# Altium schematic sheet sc16is752.SchDoc
size A4
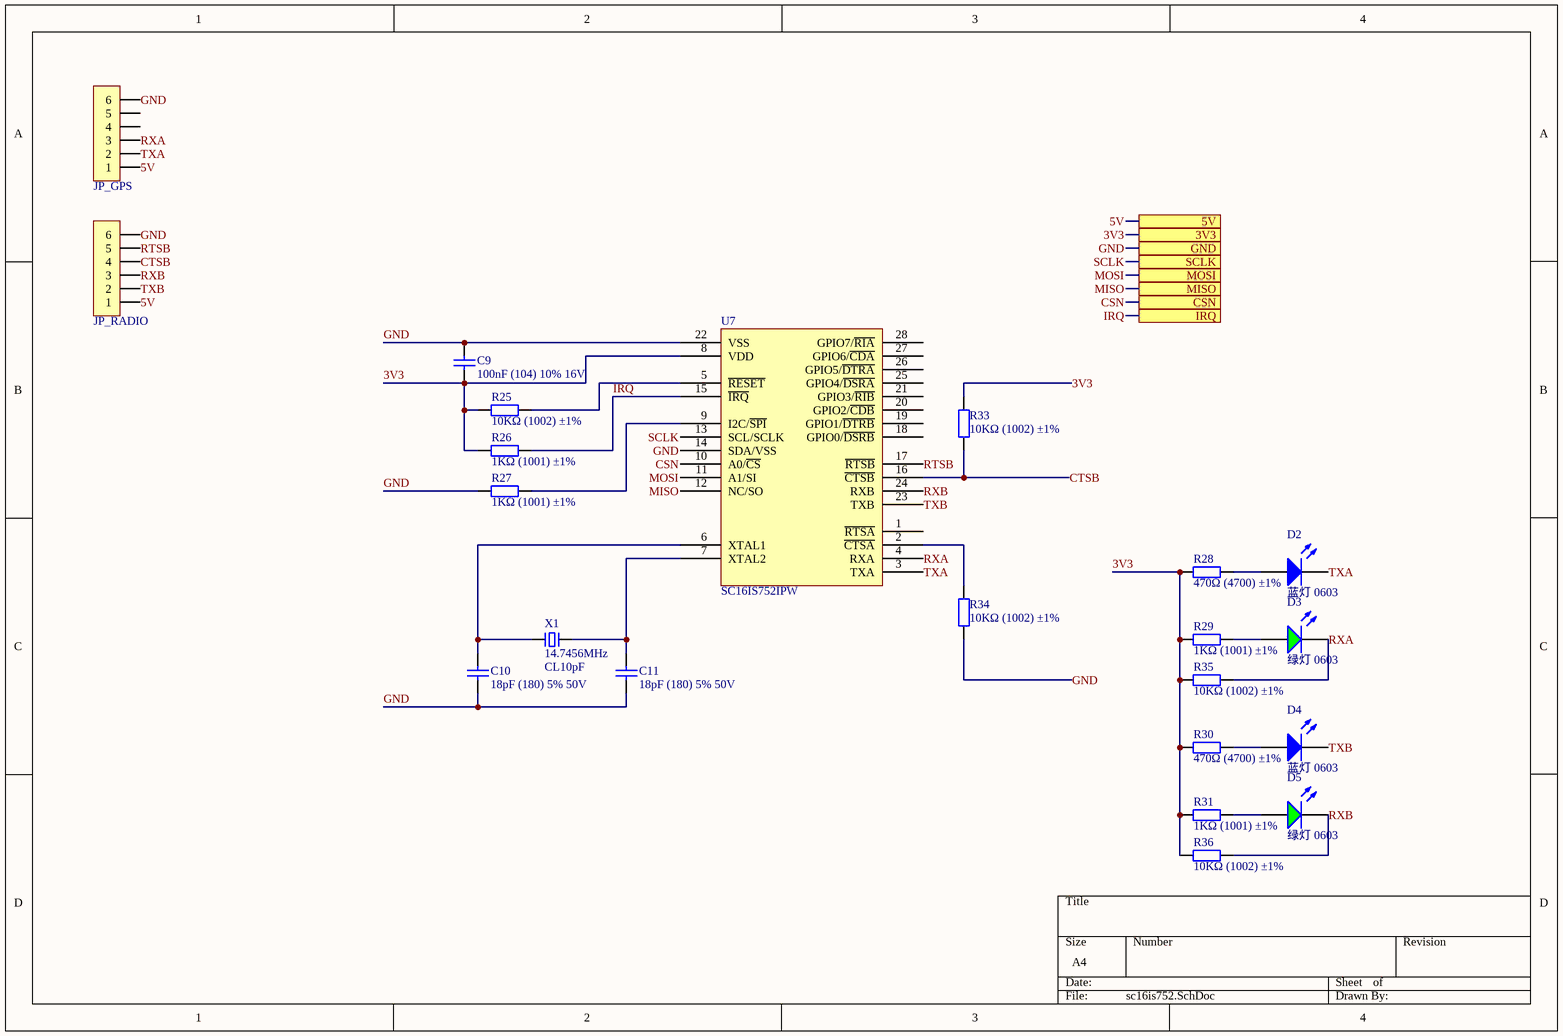
[diagram p0: sc16is752.SchDoc]

## Parts
C9  100nF (104) 10% 16V  [0402_C]
C10  18pF (180) 5% 50V  [0402_C]
C11  18pF (180) 5% 50V  [0402_C]
D2  蓝灯 0603  [0603_LED_S1]
D3  绿灯 0603  [0603_LED_S1]
D4  蓝灯 0603  [0603_LED_S1]
D5  绿灯 0603  [0603_LED_S1]
JP_GPS  HDR-1X6  [MX 1.25-WS-6P]  (value not drawn)
JP_RADIO  HDR-1X6  [MX 1.25-WS-6P]  (value not drawn)
R25  10KΩ (1002) ±1%  [0402_R]
R26  1KΩ (1001) ±1%  [0402_R]
R27  1KΩ (1001) ±1%  [0402_R]
R28  470Ω (4700) ±1%  [0402_R]
R29  1KΩ (1001) ±1%  [0402_R]
R30  470Ω (4700) ±1%  [0402_R]
R31  1KΩ (1001) ±1%  [0402_R]
R33  10KΩ (1002) ±1%  [0402_R]
R34  10KΩ (1002) ±1%  [0402_R]
R35  10KΩ (1002) ±1%  [0402_R]
R36  10KΩ (1002) ±1%  [0402_R]
U7  SC16IS752IPW  [TSSOP28_n]
X1  14.7456MHz  负载电容: CL10pF  [OSC HC-49SMD]

## Ports
3V3, 5V, CSN, GND, IRQ, MISO, MOSI, SCLK

## Nets
3V3: C9.1 R25.1 R26.1 R28.1 R29.1 R30.1 R31.1 R33.2 R35.2 R36.2 U7.8(VDD) ; port 3V3
5V: JP_GPS.1 JP_RADIO.1 ; port 5V
CSN: U7.10(A0/~{CS}) ; port CSN
CTSB: JP_RADIO.4 R33.1 U7.16(~{CTSB})
GND: C9.2 C10.1 C11.1 JP_GPS.6 JP_RADIO.6 R27.1 R34.1 U7.14(SDA/VSS) U7.22(VSS) ; port GND
IRQ: R26.2 U7.15(~{IRQ}) ; port IRQ
MISO: U7.12(NC/SO) ; port MISO
MOSI: U7.11(A1/SI) ; port MOSI
RTSB: JP_RADIO.5 U7.17(~{RTSB})
RXA: D3.K JP_GPS.3 R35.1 U7.4(RXA)
RXB: D5.K JP_RADIO.3 R36.1 U7.24(RXB)
SCLK: U7.13(SCL/SCLK) ; port SCLK
TXA: D2.K JP_GPS.2 U7.3(TXA)
TXB: D4.K JP_RADIO.2 U7.23(TXB)
NetC10_2: C10.2 U7.6(XTAL1) X1.1
NetC11_2: C11.2 U7.7(XTAL2) X1.2
NetD2_A: D2.A R28.2
NetD3_A: D3.A R29.2
NetD4_A: D4.A R30.2
NetD5_A: D5.A R31.2
NetR25_2: R25.2 U7.5(~{RESET})
NetR27_2: R27.2 U7.9(I2C/~{SPI})
NetR34_2: R34.2 U7.2(~{CTSA})

Not connected (* = marked no-connect by the designer): JP_GPS 4 5; U7 1(~{RTSA}) 18(GPIO0/~{DSRB}) 19(GPIO1/~{DTRB}) 20(GPIO2/~{CDB}) 21(GPIO3/~{RIB}) 25(GPIO4/~{DSRA}) 26(GPIO5/~{DTRA}) 27(GPIO6/~{CDA}) 28(GPIO7/~{RIA})

## Library data of the parts
C9 = 0402 100nF (104) 10% 16V: 贴片电容; ComponentLink1Description: 供应商链接; ComponentLink1URL: http://www.szlcsc.com/product/details_1877.html; Package: 0402; Supplier: LC; SuppliersPartNumber: C1525
C10 C11 = 0402 18pF (180) 5% 50V: 贴片电容; ComponentLink1Description: 供应商链接; ComponentLink1URL: http://www.szlcsc.com/product/details_1901.html; Package: 0402; Supplier: LC; SuppliersPartNumber: C1549
D2 D4 = 0603 蓝灯: 发光二极管; ComponentLink1Description: 供应商链接; ComponentLink1URL: http://www.szlcsc.com/product/details_73150.html; Package: 0603; Supplier: LC; SuppliersPartNumber: C72041
D3 D5 = 0603 绿灯: 发光二极管; ComponentLink1Description: 供应商链接; ComponentLink1URL: http://www.szlcsc.com/product/details_73152.html; Package: 0603; Supplier: LC; SuppliersPartNumber: C72043
JP_GPS JP_RADIO = Header 6: 6P接插件; 版权归属: 源创客; BOM名称: 6P接插件; 学习资源: www.ooocke.com
R25 R33-R36 = 0402 10KΩ (1002) 1%: 贴片电阻; ComponentLink1Description: 供应商链接; ComponentLink1URL: http://www.szlcsc.com/product/details_26487.html; Package: 0402; Supplier: LC; SuppliersPartNumber: C25744
R26 R27 R29 R31 = 0402 1KΩ (1001) 1%: 贴片电阻; ComponentLink1Description: 供应商链接; ComponentLink1URL: http://www.szlcsc.com/product/details_12256.html; Package: 0402; Supplier: LC; SuppliersPartNumber: C11702
R28 R30 = 0402 470Ω (4700) 1%: 贴片电阻; ComponentLink1Description: 供应商链接; ComponentLink1URL: http://www.szlcsc.com/product/details_25860.html; Package: 0402; Supplier: LC; SuppliersPartNumber: C25117
X1 = XTAL-2P: 2脚无源脚晶振; 版权归属: 源创客; BOM名称: 2脚无源脚晶振; 学习资源: www.ooocke.com